# EAGLE design EBUS2.2 (EAGLE 9.6.2)
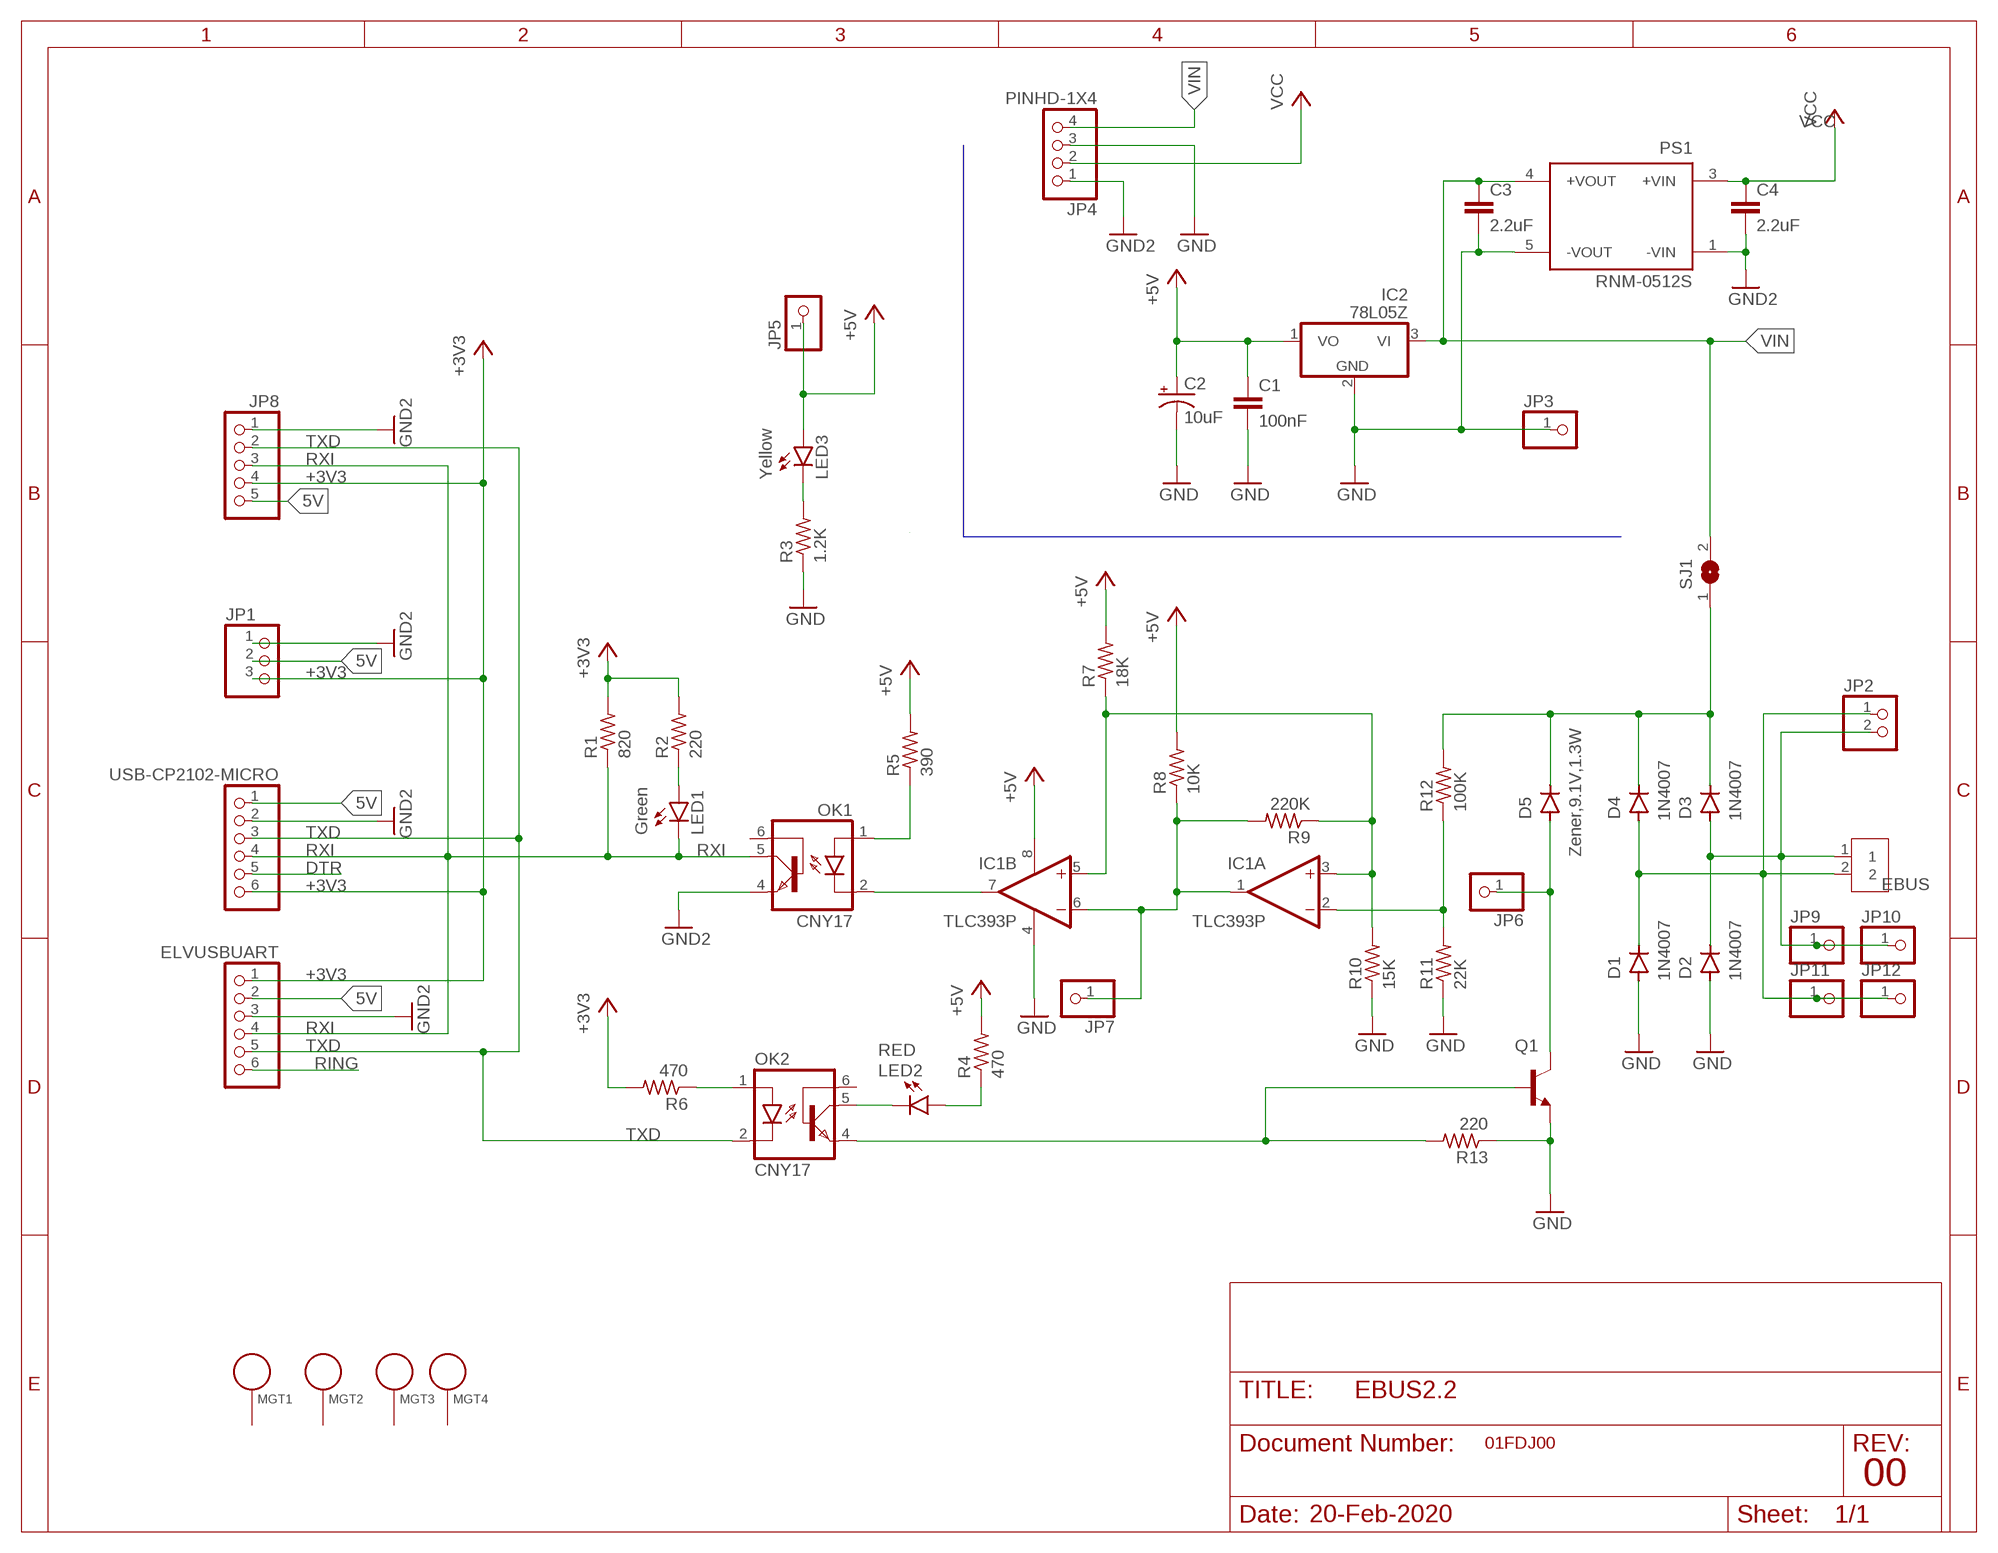
[diagram p0: schematic, sheet 1]

## Parts
C1  100nF  0.1UF-KIT-EZ-50V-20%  [CAP-PTH-SMALL-KIT]
C2  10uF  10UF-POLAR-RADIAL-2.5MM-KIT-25V-20%  [CPOL-RADIAL-2.5MM-5MM-KIT]
C3  2.2uF  0.1UF-KIT-EZ-50V-20%  [CAP-PTH-SMALL-KIT]
C4  2.2uF  0.1UF-KIT-EZ-50V-20%  [CAP-PTH-SMALL-KIT]
D1  1N4007  [DO-41]
D2  1N4007  [DO-41]
D3  1N4007  [DO-41]
D4  1N4007  [DO-41]
D5  Zener,9.1V,1.3W  1N4007  [DO-41]
EBUS  2828XX-2282837-2  [TERMBLK_508-2N]
ELVUSBUART  PINHD-1X6  [1X06]
IC1  TLC393P  [DIL08]
IC2  78L05Z  [TO92]
JP1  PINHD-1X3  [1X03]
JP2  PINHD-1X2  [1X02]
JP3  PINHD-1X1  [1X01]
JP4  PINHD-1X4  [1X04]
JP5  PINHD-1X1  [1X01]
JP6  PINHD-1X1  [1X01]
JP7  PINHD-1X1  [1X01]
JP8  PINHD-1X5  [1X05]
JP9  PINHD-1X1  [1X01]
JP10  PINHD-1X1  [1X01]
JP11  PINHD-1X1  [1X01]
JP12  PINHD-1X1  [1X01]
LED1  Green  LED5MM  [LED5MM]
LED2  RED  LED5MM  [LED5MM]
LED3  Yellow  LED5MM  [LED5MM]
MGT1  MOUNTING_HOLE  [BEAGLEBONEBLACK_MOUNTING_HOLE]
MGT2  MOUNTING_HOLE  [BEAGLEBONEBLACK_MOUNTING_HOLE]
MGT3  MOUNTING_HOLE  [BEAGLEBONEBLACK_MOUNTING_HOLE]
MGT4  MOUNTING_HOLE  [BEAGLEBONEBLACK_MOUNTING_HOLE]
OK1  CNY17  [DIL06]
OK2  CNY17  [DIL06]
PS1  RNM-0512S  [CONV_RNM-0512S]
Q1  BC337-NPN-TO92-CBE  [TO92-CBE]
R1  820  R-US_0204/7  [0204/7]
R2  220  R-US_0204/7  [0204/7]
R3  1.2K  R-US_0204/7  [0204/7]
R4  470  R-US_0204/7  [0204/7]
R5  390  R-US_0204/7  [0204/7]
R6  470  R-US_0204/7  [0204/7]
R7  18K  R-US_0204/7  [0204/7]
R8  10K  R-US_0204/7  [0204/7]
R9  220K  R-US_0204/7  [0204/7]
R10  15K  R-US_0204/7  [0204/7]
R11  22K  R-US_0204/7  [0204/7]
R12  100K  R-US_0204/7  [0204/7]
R13  220  R-US_0204/7  [0204/7]
SJ1  SJW  [SJW]
USB-CP2102-MICRO  PINHD-1X6  [1X06]

## Nets
5V: ELVUSBUART.2 JP1.2 JP8.5 USB-CP2102-MICRO.1
+3V3: ELVUSBUART.1 JP1.3 JP8.4 R1.2 R2.2 R6.2 USB-CP2102-MICRO.6
+5V: C1.1 C2.1(+) IC1.8(P:V+) IC2.1(VO) JP5.1 LED3.A R4.2 R5.2 R7.2 R8.2
DTR: USB-CP2102-MICRO.5
GND: C1.2 C2.2(-) C3.2 C4.2 D1.A D2.A ELVUSBUART.3 IC1.4(P:V-) IC2.2(GND) JP1.1 JP3.1 JP4.1 JP4.3 JP8.1 OK1.4(EMI) PS1.1(-VIN) PS1.5(-VOUT) Q1.E R3.1 R10.1 R11.1 R13.1 USB-CP2102-MICRO.2 ; supply symbol labelled GND2
N$2: LED3.K(C) R3.2
N$3: LED1.A R2.1
N$4: LED2.A R4.1
N$5: IC1.7(B:OUT) OK1.2(C)
N$6: OK1.1(A) R5.1
N$7: IC1.2(A:-IN) R11.2 R12.1
N$8: OK2.1(A) R6.1
N$9: IC1.1(A:OUT) IC1.6(B:-IN) JP7.1 R8.1 R9.2
N$10: IC1.3(A:+IN) IC1.5(B:+IN) R7.1 R9.1 R10.2
N$11: D3.C D4.C D5.C R12.2 SJ1.1
N$12: LED2.K(C) OK2.5(COL)
N$13: D5.A JP6.1 Q1.C
N$14: D2.C D3.A EBUS.1 JP2.2 JP9.1 JP10.1
N$15: D1.C D4.A EBUS.2 JP2.1 JP11.1 JP12.1
N$16: OK2.4(EMI) Q1.B R13.2
RING: ELVUSBUART.6
RXI: ELVUSBUART.4 JP8.3 LED1.K(C) OK1.5(COL) R1.1 USB-CP2102-MICRO.4
TXD: ELVUSBUART.5 JP8.2 OK2.2(C) USB-CP2102-MICRO.3
VCC: C4.1 JP4.2 PS1.3(+VIN)
VIN: C3.1 IC2.3(VI) JP4.4 PS1.4(+VOUT) SJ1.2
Unconnected: MGT1.P$1 MGT2.P$1 MGT3.P$1 MGT4.P$1 OK1.6(BAS) OK2.6(BAS)

## Notes on the sheet
- 01FDJ00
- 00
- 20-Feb-2020

## Library data of the parts
C1 C3 C4 = SparkFun-Capacitors:0.1UF: 0.1µF ceramic capacitors A capacitor is a passive two-terminal electrical component used to store electrical energy temporarily in an electric field.; PROD_ID: CAP-08370; VALUE: 0.1uF
C2 = SparkFun-Capacitors:10UF-POLAR: 10.0µF polarized capacitors A capacitor is a passive two-terminal electrical component used to store electrical energy temporarily in an electric field.; PROD_ID: CAP-08440
D1-D5 = Diodes:1N4007: DIODE GEN PURP 1KV 1A DO41 Manufacturer's datasheet <https://www.mccsemi.com/pdf/Products/1N4001-1N4007(DO-41).pdf>; CREATED_BY: PCBLayout.com; DIGIKEY_PART_NUMBER: 1N4007MSCT-ND; MANUFACTURER: Micro Commercial Co; MPN: 1N4007; PACKAGE: DO-41
EBUS = Connector:2828XX-2: 2 Position Wire to Board Terminal Block Horizontal with Board Datasheet <https://www.te.com.cn/commerce/DocumentDelivery/DDEController?Action=showdoc&DocId=Catalog+Section%7F1308389_EUROSTYLE_TERMINAL_BLOCKS%7F0607%7Fpdf%7FEnglish%7FENG_CS_1308389_EUROSTYLE_TERMINAL_BLOCKS_0607.pdf%7F2-282837-5>; CATEGORY: Connector; DESCRIPTION: 2 Position Wire to Board Terminal Block Horizontal with Board 5.08 mm Through Hole; MANUFACTURER: TE Connectivity; MPN: 282837-2; OPERATING_TEMPERATURE: -40°C to +105°C; PART_STATUS: ACTIVE; ROHS_COMPLIANCE: RoHS Compliant; SERIES: 282837; SUBCATEGORY: Terminal Block; TYPE: Side Wire Entry
ELVUSBUART USB-CP2102-MICRO = pinhead:PINHD-1X6: PIN HEADER
IC1 = linear:TLC393: COMPARATOR
IC2 = linear:78*: Positive VOLTAGE REGULATOR Source: http://cache.national.com/ds/LM/LM78L05.pdf http://www.fairchildsemi.com/ds/LM/LM7805.pdf
JP1 = pinhead:PINHD-1X3: PIN HEADER
JP2 = pinhead:PINHD-1X2: PIN HEADER
JP3 JP5-JP7 JP9-JP12 = pinhead:PINHD-1X1: PIN HEADER
JP4 = Connector:PINHD-1X4: PIN HEADER; CATEGORY: CONNECTOR; SUB-CATEGORY: PIN-HEADER
JP8 = pinhead:PINHD-1X5: PIN HEADER
LED1-LED3 = led:LED: LED OSRAM: - CHIPLED LG R971, LG N971, LY N971, LG Q971, LY Q971, LO R971, LY R971 LH N974, LH R974 LS Q976, LO Q976, LY Q976 LO Q996 - Hyper CHIPLED LW Q18S LB Q993, LB Q99A, LB R99A - SideLED LS A670, LO A670, LY A670, LG A670, LP A670 LB A673, LV A673, LT A673, LW A673 LH A674 LY A675 LS A676, LA A676, LO A676, LY A676, LW A676 LS A679, LY A679, LG A679 - Hyper Micro SIDELED® LS Y876, LA Y876, LO Y876, LY Y876 LT Y87S - SmartLED LW L88C, LW L88S LB L89C, LB L89S, LG L890 LS L89K, LO L89K, LY L89K LS L896, LA L896, LO L896, LY L896 - TOPLED LS T670, LO T670, LY T670, LG T670, LP T670 LSG T670, LSP T670, LSY T670, LOP T670, LYG T670 LG T671, LOG T671, LSG T671 LB T673, LV T673, LT T673, LW T673 LH T674 LS T676, LA T676, LO T676, LY T676, LB T676, LH T676, LSB T676, LW T676 LB T67C, LV T67C, LT T67C, LS T67K, LO T67K, LY T67K, LW E67C LS E67B, LA E67B, LO E67B, LY E67B, LB E67C, LV E67C, LT E67C LW T67C LS T679, LY T679, LG T679 LS T770, LO T770, LY T770, LG T770, LP T770 LB T773, LV T773, LT T773, LW T773 LH T774 LS E675, LA E675, LY E675, LS T675 LS T776, LA T776, LO T776, LY T776, LB T776 LHGB T686 LT T68C, LB T68C - Hyper Mini TOPLED® LB M676 - Mini TOPLED Santana® LG M470 LS M47K, LO M47K, LY M47K Source: http://www.osram.convergy.de LUXEON: - LUMILED® LXK2-PW12-R00, LXK2-PW12-S00, LXK2-PW14-U00, LXK2-PW14-V00 LXK2-PM12-R00, LXK2-PM12-S00, LXK2-PM14-U00 LXK2-PE12-Q00, LXK2-PE12-R00, LXK2-PE12-S00, LXK2-PE14-T00, LXK2-PE14-U00 LXK2-PB12-K00, LXK2-PB12-L00, LXK2-PB12-M00, LXK2-PB14-N00, LXK2-PB14-P00, LXK2-PB14-Q00 LXK2-PR12-L00, LXK2-PR12-M00, LXK2-PR14-Q00, LXK2-PR14-R00 LXK2-PD12-Q00, LXK2-PD12-R00, LXK2-PD12-S00 LXK2-PH12-R00, LXK2-PH12-S00 LXK2-PL12-P00, LXK2-PL12-Q00, LXK2-PL12-R00 Source: www.luxeon.com KINGBRIGHT: KA-3528ASYC Source: www.kingbright.com
MGT1-MGT4 = BeagleBone_Blue_R3:MOUNTING_HOLE: Chassis Mounting Hole w/GND connection ability
OK1 OK2 = optocoupler:CNY17: SIEMENS OPTO COUPLER; MPN: CNY17-1; OC_FARNELL: 1045399; OC_NEWARK: 05M4044
PS1 = RNM-0512S:RNM-0512S: DC/DC Converter, 1 Watt DIP6 Single Output Check prices <https://pricing.snapeda.com/parts/RNM-0512S/Recom%20Power/view-part?ref=eda>; AVAILABILITY: Warning; DESCRIPTION: 1W DC/DC-Converter 'ECONOLINE' DIP6 1kV unreg; MF: Recom Power; MP: RNM-0512S; PACKAGE: DIP-6 Recom Power; PRICE: None; PURCHASE-URL: https://pricing.snapeda.com/search/part/RNM-0512S/?ref=eda
Q1 = DC_LOAD_AU:*-NPN-: NPN Transistror BF959 corrected 2008.03.06
R1-R13 = BeagleBone_Black_Wireless:R-US_: RESISTOR, American symbol
SJ1 = jumper:SJ: SMD solder JUMPER

## Board
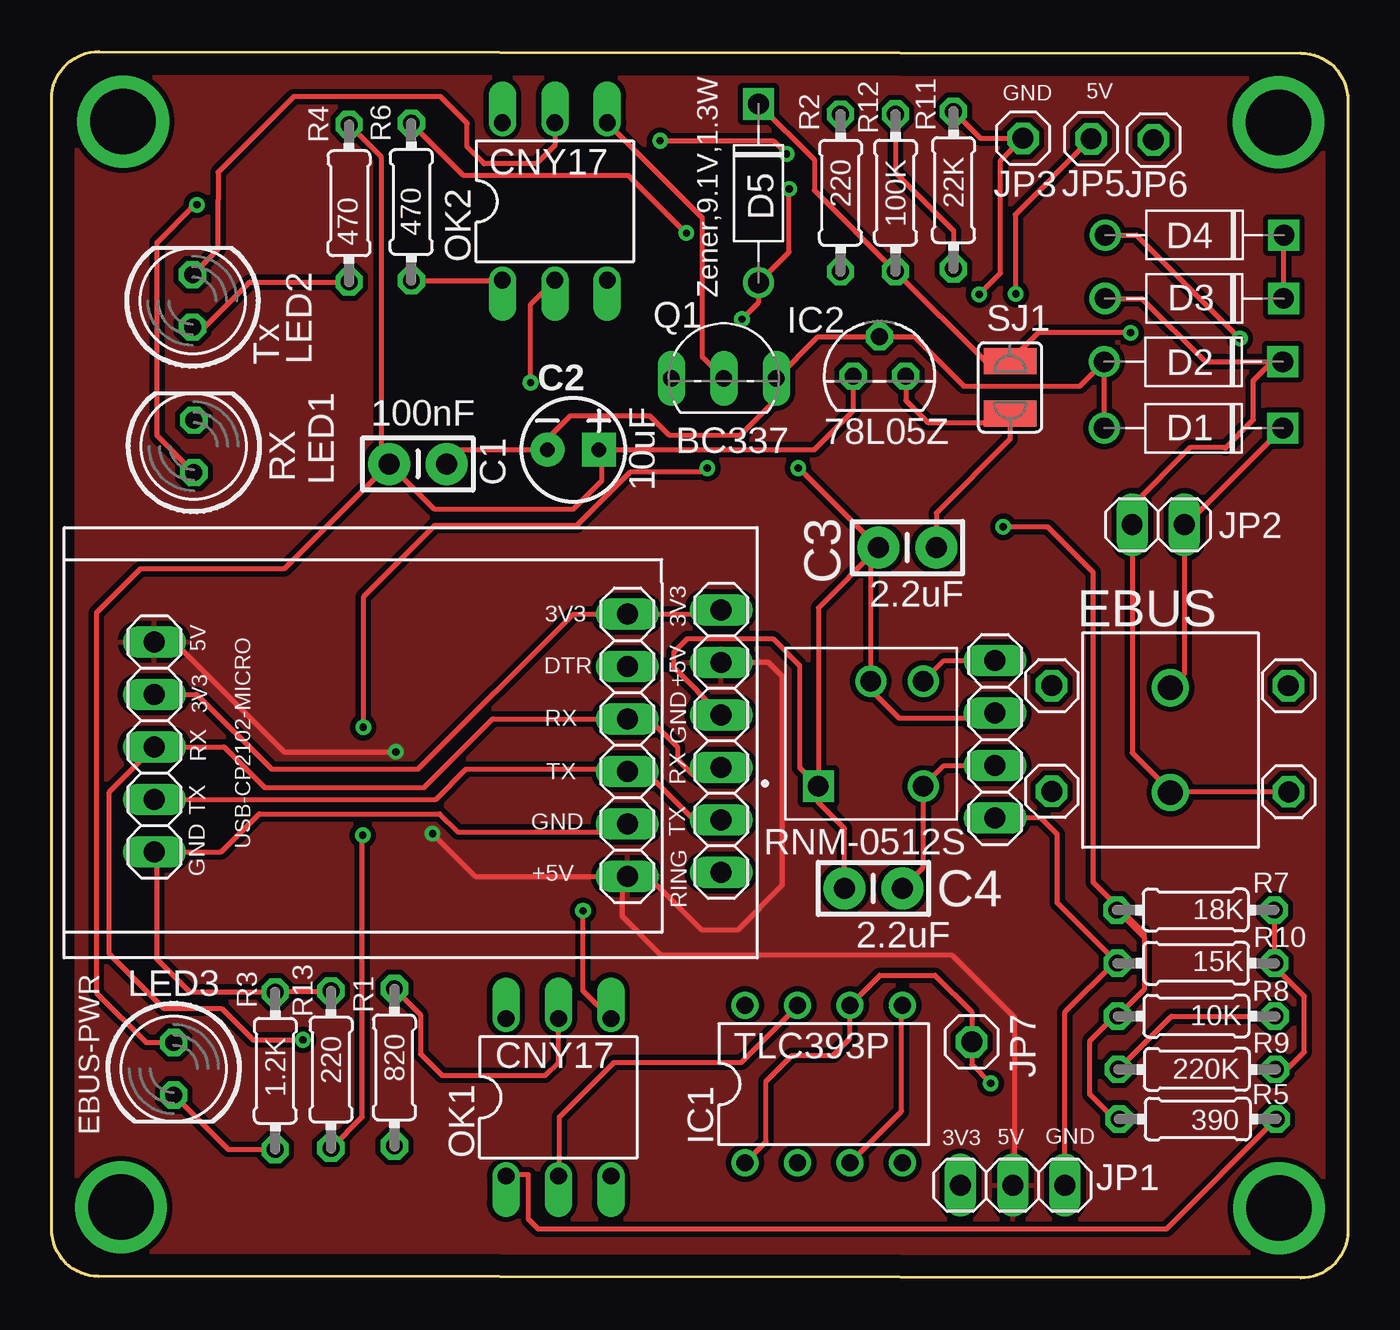
[diagram p1: board, top side]
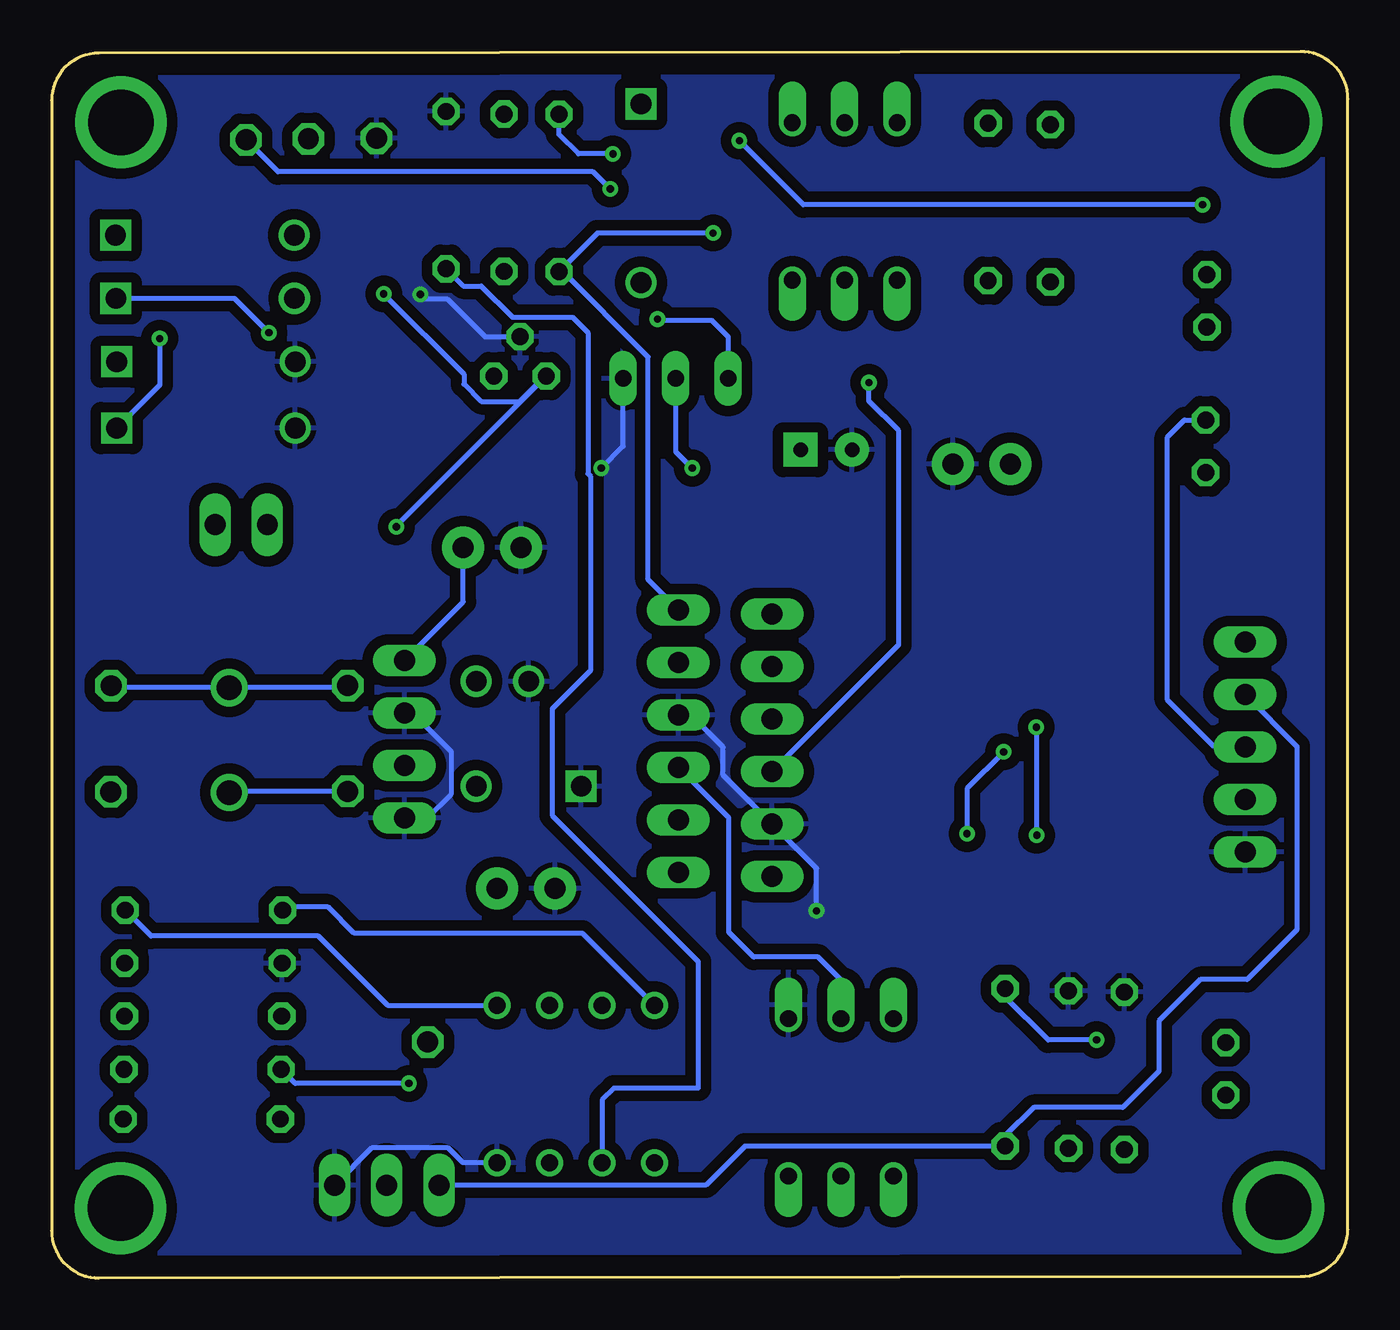
[diagram p2: board, bottom side, seen from below]

Size 62.76 x 59.38 mm. Coordinates in mm from the lower left corner, seen from the top.
Outline: 62.76,57.02 62.76,2.29 arc-90 60.47,0 2.28,0.07 arc-90 0,2.36 0,57.09 arc-90 2.29,59.38 60.48,59.31 arc-90 62.76,57.02
Copper layers (1*16): Top 0.035mm / dielectric 1.5mm / Bottom 0.035mm
Design rules "default": minimum track width 6mil, minimum drill 0.35mm, track to track 6mil, track to pad 6mil, pad to pad 6mil, via to via 6mil, smd to smd 6mil, copper to edge 40mil, drill to drill 6mil, minimum pad ring 10mil, minimum via ring 8mil, stop-mask expansion 4mil, vias tented up to drill 0mil, thermal gap 10mil

### Footprints (pad centres in the part's own frame; a part is rotated, then mirrored left to right if it is on the bottom)
CAP-PTH-SMALL-KIT = drill 1.016 pad 2.032: 1 -1.397,0; 2 1.397,0
CPOL-RADIAL-2.5MM-5MM-KIT = drill 0.7 pad 1.651 square: 1 1.25,0 | drill 0.7 pad 1.651: 2 -1.25,0
DO-41 = drill 1: A 4.325,0 | drill 1 square: C -4.325,0
TERMBLK_508-2N = drill 1.2: 1 0,0; 2 5.08,0
1X06 = drill 1.016 long: 1 -6.35,0; 2 -3.81,0; 3 -1.27,0; 4 1.27,0; 5 3.81,0; 6 6.35,0
DIL08 = drill 0.813 pad 1.27: 1 -3.81,-3.81; 2 -1.27,-3.81; 3 1.27,-3.81; 4 3.81,-3.81; 5 3.81,3.81; 6 1.27,3.81; 7 -1.27,3.81; 8 -3.81,3.81
TO92 = drill 0.813 octagon: 1 -1.27,0; 2 0,1.905; 3 1.27,0
1X03 = drill 1.016 long: 1 -2.54,0; 2 0,0; 3 2.54,0
1X02 = drill 1.016 long: 1 -1.27,0; 2 1.27,0
1X01 = drill 1.016 octagon: 1 0,0
1X04 = drill 1.016 long: 1 -3.81,0; 2 -1.27,0; 3 1.27,0; 4 3.81,0
1X05 = drill 1.016 long: 1 -5.08,0; 2 -2.54,0; 3 0,0; 4 2.54,0; 5 5.08,0
LED5MM = drill 0.813 octagon: A -1.27,0; K 1.27,0
BEAGLEBONEBLACK_MOUNTING_HOLE = drill 3.175 pad 4.445: P$1 0,0
DIL06 = drill 0.813 offset: 1 -2.54,-3.81; 2 0,-3.81; 3 2.54,-3.81; 4 2.54,3.81; 5 0,3.81; 6 -2.54,3.81
CONV_RNM-0512S = drill 1 square: 1 -2.55,-2.54 | drill 1: 3 2.53,-2.54; 4 2.53,2.54; 5 -0.01,2.54
TO92-CBE = drill 0.813 long: B 0,0; C -2.54,0; E 2.54,0
0204/7 = drill 0.813 octagon: 1 -3.81,0; 2 3.81,0
SJW = smd 1.27 x 2.54: 1 -1.27,0; 2 1.27,0

### Placement (x,y rotation side)
C1  17.73,39.42 0 top
C2  25.25,40.11 0 top
C3  41.44,35.36 180 top
C4  39.79,18.86 180 top
D1  55.29,41.15 180 top
D2  55.29,44.36 180 top
D3  55.33,47.43 180 top
D4  55.34,50.49 180 top
D5  34.22,52.52 270 top
EBUS  54.17,23.5 90 top
ELVUSBUART  32.42,26 270 top
IC1  37.38,9.39 0 top
IC2  40.09,43.67 0 top
JP1  46.53,4.49 180 top
JP2  53.59,36.47 180 top
JP3  47.04,55.18 270 top
JP4  45.68,26.08 90 top
JP5  50.33,55.16 270 top
JP6  53.35,55.11 90 top
JP7  44.55,11.42 270 top
JP8  4.98,25.71 90 top
JP9  48.43,23.56 0 top
JP10  59.9,23.54 0 top
JP11  59.89,28.68 0 top
JP12  48.43,28.68 0 top
LED1  6.88,40.27 90 top
LED2  6.82,47.31 90 top
LED3  5.91,10.13 270 top
MGT1  3.36,3.43 0 top
MGT2  59.43,3.38 0 top
MGT3  3.46,55.99 0 top
MGT4  59.4,55.96 0 top
OK1  24.54,8.75 0 top
OK2  24.36,52.13 0 top
PS1  39.67,26.35 0 top
Q1  32.55,43.56 0 top
R1  16.6,10.2 270 top
R2  38.19,52.54 270 top
R3  10.83,10.03 270 top
R4  14.4,52.04 90 top
R5  55.49,7.69 180 top
R6  17.41,52.1 90 top
R7  55.39,17.81 180 top
R8  55.43,12.68 180 top
R9  55.46,10.1 180 top
R10  55.41,15.24 0 top
R11  43.67,52.68 270 top
R12  40.86,52.55 270 top
R13  13.53,10.09 270 top
SJ1  46.41,43.12 270 top
USB-CP2102-MICRO  27.88,25.8 90 top

### Tracks (layer width: path | path; a pad name or v marks a point on that pad's centre or on a via)
5V  (via drill 0.35)
  Top 0.254: JP8.5 5.93,30.8 11.25,25.47 v16.66,25.47 | v18.44,21.51 20.5,19.45 27.64,19.45 | 27.64,19.45 USB-CP2102-MICRO.1 28.89,19.45 31.47,16.86 33.22,16.86 35.38,19.02 35.38,29.13 34.71,29.81 ELVUSBUART.2 | JP1.2 46.63,4.6 46.63,12.6 43.61,15.62 29.51,15.62 27.64,17.5 27.64,19.45
  Bottom 0.254: v16.66,25.47 18.44,23.7 v18.44,21.51
  pour Top (isolate 0.254): 0.99,56.44 2.9,58.34 9.12,58.34 60.81,58.34 62.2,56.94 62.2,2.33 61.06,1.19 1.75,1.19 0.74,2.21 0.74,56.18
+3V3  (via drill 0.35)
  Top 0.254: R6.2 19.93,53.39 27.91,53.39 30.71,50.59 v30.73,50.59 | JP8.4 7.02,28.26 10.64,24.64 17.75,24.64 25.27,32.15 USB-CP2102-MICRO.6 32.22,32.15 ELVUSBUART.1
  Bottom 0.254: v30.73,50.59 36.33,50.59 38.1,48.82 | 38.1,48.82 R2.2 | JP8.4 2.46,25.74 2.46,16.86 4.88,14.45 7.14,14.45 9.14,12.44 9.14,10.01 10.9,8.25 15.21,8.25 16.6,6.87 R1.2 29.2,6.39 31.09,4.49 JP1.3 | ELVUSBUART.1 33.88,33.81 33.88,44.6 38.1,48.82
+5V  (via drill 0.35)
  Top 0.254: R4.2 15.95,54.3 15.95,39.8 C1.1 | C1.1 11.26,34.34 4.29,34.34 2.16,32.2 2.16,13.82 4.57,11.4 LED3.A | C1.1 18.52,37.23 25.27,37.23 26.64,38.61 26.64,39.97 C2.1 36.94,40.11 38.82,41.99 IC2.1 38.82,43.42 | JP5.1 46.66,51.49 46.66,47.67 v46.69,47.65 | 52.91,16.49 52.91,13.96 51.73,12.79 | 52.91,16.49 R7.2 | R8.2 51.73,12.79 | 52.91,16.49 52.91,16.68 50.44,19.15 50.44,34.17 48.23,36.37 v46.08,36.37 | R5.2 51.46,7.69 50.27,8.89 50.27,11.48 51.57,12.79 51.73,12.79
  Bottom 0.254: v46.69,47.65 42.8,43.76 42.8,43.28 41.96,42.44 40.11,42.44 38.88,43.67 IC2.1 46.08,36.41 v46.08,36.37 | IC1.8 37.06,16.69 48.11,16.69 49.38,17.96 51.44,17.96 R7.2
GND  (via drill 0.35)
  Top 0.254: C1.2 19.82,40.11 C2.2 24,40.64 25.12,41.76 28.96,41.76 29.9,40.82 33.35,40.82 35.09,42.55 Q1.E 37.1,45.58 IC2.2 41.77,45.58 44.17,43.18 49.78,43.18 D2.A | R13.1 13.47,13.84 R3.1 6.68,13.84 5.08,15.44 5.08,20.53 JP8.1 8.22,20.64 10.06,22.48 18.8,22.48 19.68,21.59 27.48,21.59 USB-CP2102-MICRO.2 | C3.2 37.12,32.45 PS1.1 | C3.2 39.66,34.99 PS1.5 39.66,28.48 41.05,27.1 45.42,27.1 JP4.3 | C4.2 38.39,21.77 37.12,23.03 PS1.1 | ELVUSBUART.3 30.12,29.56 30.12,30.3 30.78,30.96 34.92,30.96 36.22,29.66 36.22,24.71 PS1.1 | R11.1 44.97,55.18 JP3.1 45.95,54.09 45.95,48.66 v44.91,47.62 | D1.A D2.A | D2.A | C3.2 36.19,39.22 v36.14,39.22 | OK1.4 25.73,13.91 v25.73,17.78 | R10.1 51.52,15.32 | 51.52,15.32 48.69,18.15 48.69,21.49 47.9,22.27 JP4.1 | 51.52,15.32 49.07,12.87 JP1.1 48.77,4.49
  Bottom 0.254: ELVUSBUART.3 31.82,27.27 30.25,25.7 30.25,24.36 USB-CP2102-MICRO.2 25.73,19.84 v25.73,17.78 | v36.14,39.22 35.09,40.27 Q1.E | JP4.1 44.58,22.27 43.41,23.44 43.41,25.47 45.29,27.35 JP4.3 | v44.91,47.62 44.7,47.42 43.62,47.42 41.78,45.58 IC2.2 | IC1.4 42.84,5.58 43.56,6.3 47.27,6.3 JP1.1
  pour Bottom (isolate 0.508): 0.48,54.66 0.48,56.94 2.39,58.85 60.3,58.85 61.95,57.2 61.95,2.08 60.55,0.68 2.51,0.68 0.61,2.59 0.48,2.72
N$2
  Top 0.254: LED3.K 8.55,6.22 R3.2
N$3  (via drill 0.35)
  Top 0.254: LED1.A 5.11,40.78 5.11,50.14 6.93,51.97 v7.04,51.97 | v29.46,55.06 34.95,55.06 v35.59,54.43
  Bottom 0.254: v7.04,51.97 26.37,51.97 v29.46,55.06 | v35.59,54.43 37.26,54.43 38.19,55.36 R2.1
N$4
  Top 0.254: LED2.A 7.41,46.04 9.6,48.23 R4.1
N$5
  Top 0.254: OK1.2 24.59,4.98 24.59,7.8 27.23,10.44 33.4,10.44 36.11,13.15 IC1.7
N$6
  Top 0.254: R5.1 53.97,2.36 23.57,2.36 23.09,2.84 23.09,5 22.07,5 OK1.1
N$7
  Top 0.254: R12.1 40.86,53.52 43.67,50.72 R11.2
  Bottom 0.254: R11.2 42.83,48.03 41.96,48.03 40.45,46.52 37.54,46.52 36.8,45.78 36.8,38.94 36.68,38.82 36.68,29.41 38.53,27.56 38.53,22.4 31.46,15.32 31.46,9.19 35.53,9.19 36.11,8.62 IC1.2
N$8
  Top 0.254: R6.1 21.8,48.29 OK2.1
N$9  (via drill 0.35)
  Top 0.254: IC1.1 34.59,6.6 34.59,9.52 35.84,10.77 37.82,10.77 38.65,11.6 IC1.6 40.11,14.65 42.77,14.65 44.55,12.87 JP7.1 44.55,10.33 v45.47,9.42 | R9.2 54.22,12.68 R8.1
  Bottom 0.254: v45.47,9.42 50.97,9.42 R9.2
N$10
  Top 0.254: IC1.3 41.15,8.08 41.15,13.16 IC1.5 | R7.1 59.22,17.79 R10.2 59.22,15.07 60.66,13.64 60.66,10.95 59.81,10.1 R9.1
  Bottom 0.254: IC1.5 46.5,13.2 49.86,16.56 57.95,16.56 R7.1
N$11  (via drill 0.35)
  Top 0.254: D5.C 36.93,54.14 36.93,52.66 R12.2 45.2,44.39 SJ1.1 47.81,45.79 52.22,45.79 v52.25,45.77 | D3.C 59.66,50.48 D4.C
  Bottom 0.254: v52.25,45.77 53.91,47.43 D3.C
N$12
  Top 0.254: LED2.K 8.05,49.81 8.05,51.23 8.05,52.17 8.05,53.54 11.71,57.2 18.82,57.2 20.12,55.9 20.12,54.76 20.93,53.95 23.47,53.95 24.36,54.84 OK2.5
N$13  (via drill 0.35)
  Top 0.254: v35.71,52.73 35.71,49.68 D5.A 34.22,47.23 v33.43,46.43
  Bottom 0.254: v35.71,52.73 36.55,53.57 51.8,53.57 JP6.1 | v33.43,46.43 33.38,46.38 30.81,46.38 30.01,45.57 Q1.C
N$14
  Top 0.254: JP10.1 54.21,23.54 | 54.21,23.54 EBUS.1 | 54.21,23.54 52.32,25.43 JP2.2 52.32,37.4 55.14,40.23 56.77,40.23 56.82,40.18 58.19,41.55 58.19,43.41 58.17,43.43 59.1,44.36 | 59.1,44.36 59.46,44.36 D2.C | D3.A 52.8,47.43 55.86,44.36 59.1,44.36
  Bottom 0.254: JP9.1 54.11,23.56 EBUS.1
N$15  (via drill 0.35)
  Top 0.254: JP2.1 | JP2.1 54.86,29.27 EBUS.2 | D1.C 54.94,36.47 JP2.1 | D4.A 52.53,50.49 v57.53,45.49
  Bottom 0.254: JP12.1 48.53,28.58 EBUS.2 59.79,28.58 JP11.1 | v57.53,45.49 57.53,43.23 D1.C
N$16  (via drill 0.35)
  Top 0.254: OK2.4 31.5,51.35 31.5,44.61 Q1.B | R13.2 15.04,7.79 15.04,21.41 v15.06,21.44 | v31.75,39.22 31.55,39.01 28.02,39.01 25.43,36.42 18.54,36.42 15.09,32.97 v15.09,26.67
  Bottom 0.254: v15.06,21.44 15.06,26.64 v15.09,26.67 | Q1.B 32.55,40.01 v31.75,39.22
RXI  (via drill 0.35)
  Top 0.254: R1.1 17.86,12.75 17.86,10.84 18.9,9.8 23.9,9.8 24.54,10.44 OK1.5 | ELVUSBUART.4 32.05,24.36 31.06,24.36 30.3,25.12 30.3,25.7 28.94,27.07 USB-CP2102-MICRO.4 21.35,27.07 18.03,23.75 10.31,23.75 8.34,25.72 JP8.3 2.77,23.51 2.77,15.72 5.44,13.05 8.23,13.05 9.75,11.53 v12.17,11.53
  Bottom 0.254: OK1.5 24.54,14.43 25.65,15.54 28.78,15.54 29.97,16.74 29.97,22.28 ELVUSBUART.4 | v12.17,11.53 14.5,11.53 16.6,13.62 R1.1 | JP8.3 6.46,25.72 8.74,27.99 8.74,40.71 7.91,41.54 LED1.K
TXD  (via drill 0.35)
  Top 0.254: JP8.2 18.61,23.18 20.07,24.64 27.77,24.64 USB-CP2102-MICRO.3 28.76,24.53 31.1,22.19 ELVUSBUART.5 | v23.19,43.36 23.19,47.14 OK2.2
  Bottom 0.254: USB-CP2102-MICRO.3 21.74,30.67 21.74,41.02 23.19,42.47 v23.19,43.36
VCC
  Top 0.254: C4.1 42.2,19.88 PS1.3 43.21,24.81 JP4.2
VIN
  Top 0.254: PS1.4 43.21,29.89 JP4.4 | SJ1.2 46.41,41.7 | 46.41,41.7 46.41,40.61 42.83,37.04 C3.1 | IC2.3 41.36,42.49 42.42,41.43 46.13,41.43 46.41,41.7
  Bottom 0.254: JP4.4 42.83,32.74 C3.1

### Text on the board
tPlace: GND
tNames: GND | 5V | Zener,9.1V,1.3W | Tx | 100nF | BC337 | RX | C1 | 10uF | C3 | 2.2uF | 3V3 | 3V3 | 5V | DTR | +5V | 3V3 | RX | GND | RX | TX | RX | TX | GND | TX | +5V | RING | C4 | 2.2uF | EBUS-PWR | GND | 3V3 | 5V